# Altium schematic sheet Sheet1.SchDoc
size Tabloid; SheetNumber: 1; SheetTotal: 1; SPICEModelCacheXIFVOIBX: <root> / <DocumentId>XIFVOIBX</DocumentId> / <CacheFrame Number="0"> / <Model Name="3mm_151033bs03000" Kind="CKT"> / <Text>************************************************** / * Manufacturer:           Wurth Elektronik / * Kinds:                  THT Mono-color Round Waterclear / * Matchcode:              WL-TMRW / * Library Type:           LTspice / * Version:                rev22a / * Created/modified by:    Ella / * Date and Time:          2022-02-23 / * Team:                   eiSos EDA Service / * Contact:                libraries@we-online.com / ************************************************** / * Copyright(C) 2022 WÃ¼rth Elektronik eiSos GmbH &amp; Co. KG / * All Rights Reserved. / ************************************************** / * Disclaimer: While WÃ¼rth Elektronik eiSos has made every reasonable effort to ensure the accuracy / * of the simulation models provided, WÃ¼rth Elektronik eiSos does not guarantee the exemption of error on / * the simulation models, nor does WÃ¼rth Elektronik eiSos guarantee that the simulation model is current. / * WÃ¼rth Elektronik eiSos reserves the right to make any adjustments at any time without notice. / * WÃ¼rth Elektronik eiSos expressly disclaims all implied warranties regarding this simulation model. / ************************************************** / .subckt 3mm_151033BS03000  1  2 / D1 1 2 TMRW / .MODEL TMRW D / + IS=273.29E-18 / + N=2.9601 / + RS=1.0279 / + IKF=191.62E-6 / + CJO=1.0000E-12 / + M=.3333 / + VJ=.75 / + BV=5 / + IBV=50.00E-6 / + TT=5.0000E-9 / .ends</Text> / </Model> / </CacheFrame> / </root>
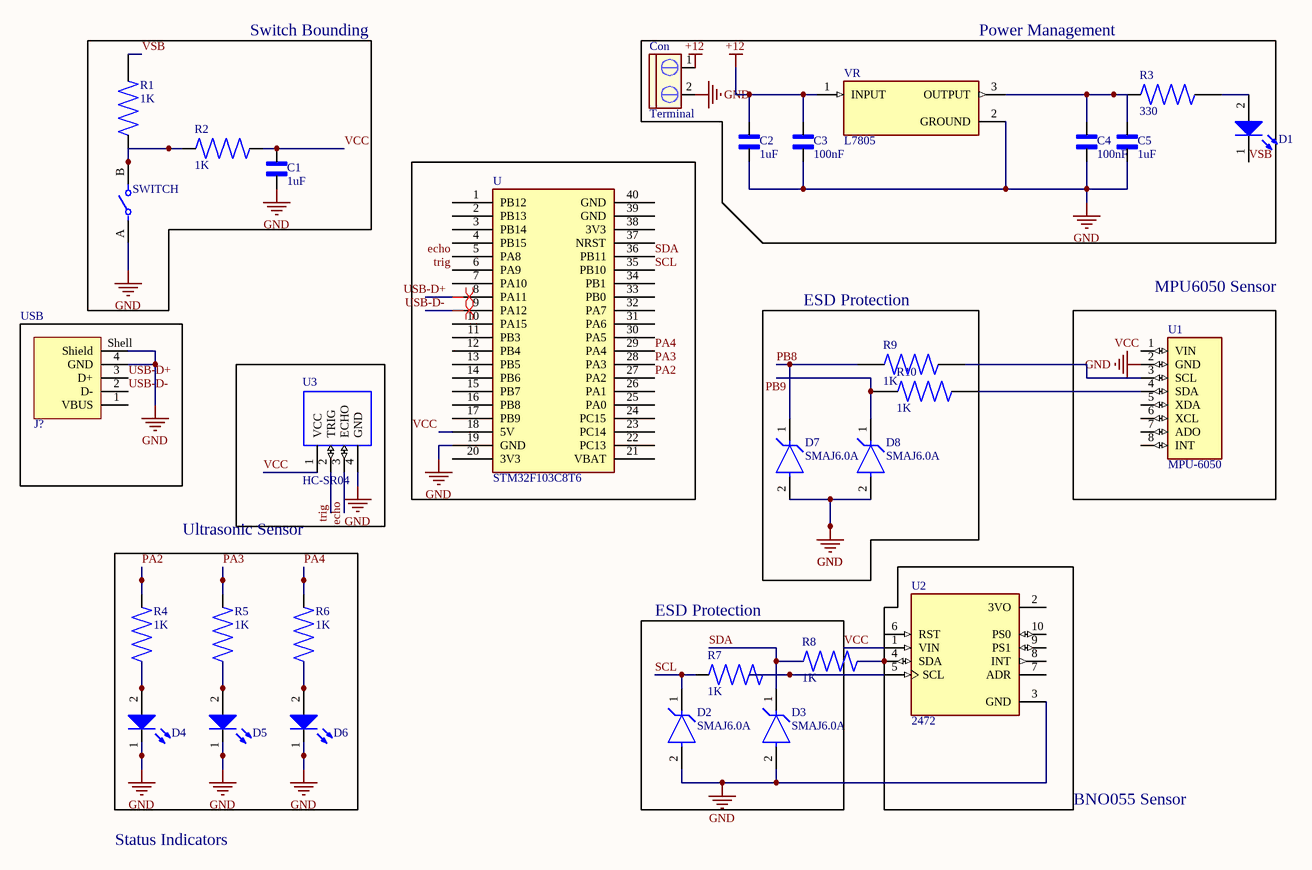
[diagram p0: Sheet1.SchDoc]

## Parts
C1  1uF  [CAPRR254W50L508T317H508]
C2  1uF  [CAPRR254W50L508T317H508]
C3  100nF  [CAPRR254W50L508T317H508]
C4  100nF  [CAPRR254W50L508T317H508]
C5  1uF  [CAPRR254W50L508T317H508]
Con  Terminal  [Terminal Block 2 Pin]
D1  Blue, 2.8V, 30°  [WL-TMRW_D3.9H10.5]  (value not drawn)
D2  SMAJ6.0A  [FP-SMAJ-MFG]
D3  SMAJ6.0A  [FP-SMAJ-MFG]
D4  Blue, 2.8V, 30°  [WL-TMRW_D3.9H10.5]  (value not drawn)
D5  Blue, 2.8V, 30°  [WL-TMRW_D3.9H10.5]  (value not drawn)
D6  Blue, 2.8V, 30°  [WL-TMRW_D3.9H10.5]  (value not drawn)
D7  SMAJ6.0A  [FP-SMAJ-MFG]
D8  SMAJ6.0A  [FP-SMAJ-MFG]
J?  614004134726  [614004134726]  (value not drawn)
R1  1K  [RESAD1100W55L680D260]
R2  1K  [RESAD1100W55L680D260]
R3  330  [RESAD1100W55L680D260]
R4  1K  [RESAD1100W55L680D260]
R5  1K  [RESAD1100W55L680D260]
R6  1K  [RESAD1100W55L680D260]
R7  1K  [RESAD1100W55L680D260]
R8  1K  [RESAD1100W55L680D260]
R9  1K  [RESAD1100W55L680D260]
R10  1K  [RESAD1100W55L680D260]
SWITCH  EVQ-11L07K  [FP-EVQ-11L07K-MFG]  (value not drawn)
U  STM32F103C8T6  [Stm32 BluePill]
U1  MPU-6050  [SEN0142]
U2  2472  [MODULE_2472]
U3  HC-SR04  [XCVR_HC-SR04]
VR  L7805  [TO255P1020X450X2000-3]

## Blocks framed on the sheet
Switch Bounding: C1 R1 R2 SWITCH
USB: J?
ESD Protection: D7 D8 R9 R10
MPU6050 Sensor: U1
Ultrasonic Sensor: D4-D6 R4-R6
ESD Protection: D2 D3 R7 R8

## Nets
+12: C2.2 C3.2 Con.1 VR.1(INPUT)
GND: C1.1 C2.1 C3.1 C4.1 C5.1 Con.2 D2.2(A) D3.2(A) D4.1(K) D5.1(K) D6.1(K) D7.2(A) D8.2(A) J?.4(GND) J?.Shell(Shield) SWITCH.A U.19(GND) U1.2(GND) U2.3(GND) U3.4(GND) VR.2(GROUND)
echo: U.5(PA8) U3.3(ECHO)
PA2: R4.2 U.27(PA2)
PA3: R5.2 U.28(PA3)
PA4: R6.2 U.29(PA4)
PB8: D7.1(C) R9.1
PB9: D8.1(C) R10.1
SCL: D2.1(C) R7.1 U.35(PB10)
SDA: D3.1(C) R8.1 U.36(PB11)
trig: U.6(PA9) U3.2(TRIG)
USB-D+: J?.3(D+) U.8(PA11)
USB-D-: J?.2(D-) U.9(PA12)
VCC: C1.2 R2.2 U.18(5V) U1.1(VIN) U2.1(VIN) U3.1(VCC)
VSB: D1.1(K) R1.2
NetC4_2: C4.2 C5.2 R3.1 VR.3(OUTPUT)
NetD1_2: D1.2(A) R3.2
NetD4_2: D4.2(A) R4.1
NetD5_2: D5.2(A) R5.1
NetD6_2: D6.2(A) R6.1
NetR1_1: R1.1 R2.1 SWITCH.B
NetR7_2: R7.2 U2.5(SCL)
NetR8_2: R8.2 U2.4(SDA)
NetR9_2: R9.2 U1.3(SCL)
NetR10_2: R10.2 U1.4(SDA)

Not connected (* = marked no-connect by the designer): J? 1(VBUS); U 1(PB12) 2(PB13) 3(PB14) 4(PB15) 7(PA10) 10(PA15) 11(PB3) 12(PB4) 13(PB5) 14(PB6) 15(PB7) 16(PB8) 17(PB9) 20(3V3) 21(VBAT) 22(PC13) 23(PC14) 24(PC15) 25(PA0) 26(PA1) 30(PA5) 31(PA6) 32(PA7) 33(PB0) 34(PB1) 37(NRST) 38(3V3) 39(GND) 40(GND); U1 5(XDA) 6(XCL) 7(ADO) 8(INT); U2 2(3VO) 6(RST) 7(ADR) 8(INT) 9(PS1) 10(PS0)

## Layout directives
differential pair: USB-D+, USB-D-

## Notes on the sheet
- Power Management
- BNO055 Sensor
- Status Indicators

## Library data of the parts
C1-C5 = SR201C104KARTR: SR 100nF Ceramic Multilayer Cap,100V dc,+125C,X7R Dielectric,+/-10%,Through Hole | AVX SR201C104KARTR; MF: KYOCERA AVX; SnapEDA_Link: https://www.snapeda.com/parts/SR201C104KARTR/Kyocera/view-part/?ref=snap; Package: None; Value: *; MP: SR201C104KARTR; Check_prices: https://www.snapeda.com/parts/SR201C104KARTR/Kyocera/view-part/?ref=eda
Con = Terminal Block 2: Connector blue screw
D1 D4-D6 = 151033BS03000: WL-TMRW Mono-color Round Waterclear, THT, D3.9 x H10.5mm, Blue, 2.8V, 30°; Manufacturer: Wurth Elektronik; Chip Technology: InGaN; Dominant Wavelength: 470nm; Luminous Intensity: 3800mcd; Peak Wavelength: 465nm; Manufacturer Part Number: 151033BS03000; Category: Signal LEDs; Match Code: WL-TMRW; ComponentLink1Description: Website Link; ComponentLink1URL: https://www.we-online.com/redexpert/article/151033BS03000?ad; ComponentLink2Description: Datasheet Link; ComponentLink2URL: https://www.we-online.com/redexpert/spec/151033BS03000?ad; Mount: Through Hole; Operating Temperature Max: 85°C; Operating Temperature Min: -40°C; Packaging: Bulk; Height: 10.5mm; Diameter: 3.9mm; Emitting Color: Blue; Forward Voltage: 2.8V; Viewing Angle: 30°
D2 D3 D7 D8 = CMP-08607-000083-1: TVS DIODE 6V 10.3V DO214AC; Manufacturer: Littelfuse; Breakdown Voltage: 6.67V; Number Of Channels: 1; Direction: Unidirectional; Max Junction Temp: +150°C; Peak Pulse Current: 38.8A; Peak Pulse Power: 400W; Device Class L1: Circuit Protection; Device Class L3: unset; ComponentLink2URL: https://www.littelfuse.com/~/media/electronics/datasheets/tvs_diodes/littelfuse_tvs_diode_smaj_datasheet.pdf.pdf; Lead Free: Yes; Digikey Description: TVS DIODE 6V 10.3V DO214AC; Height: 2.29mm; Reverse Standoff Voltage: 6V; Package: SMAJ; Manufacturer Part Number: SMAJ6.0A; Octopart: https://octopart.com/smaj6.0a-littelfuse-350212; Category: Diode; Automotive: No; Clamping Voltage: 10.3V; RoHS: TRUE; ComponentLink2Description: Datasheet; Temperature Range Low: -65°C; Temperature: -65°C to +150°C; Temperature Range High: +150°C; Device Class L2: TVS Diodes; Mouser Description: TVS Diodes - Transient Voltage Suppressors 60Vr 400W 4.1A 5% UniDirectional
J? = 614004134726: WR-COM USB 2.0 Type A Up Right; Manufacturer: Wurth Elektronik; Match Code: WR-USB; Gender: Receptacle; Interface Type: Type A; Number of Ports: 1; Rated Current: 1.5A; Working Voltage: 30V (AC); Manufacturer Part Number: 614004134726; Category: Input/Output Connectors; ComponentLink1Description: Website Link; ComponentLink1URL: https://www.we-online.com/redexpert/article/614004134726?ad; ComponentLink2Description: Datasheet Link; ComponentLink2URL: https://www.we-online.com/redexpert/spec/614004134726?ad; Mount: Through Hole; Operating Temperature Max: 105°C; Operating Temperature Min: -40°C; Packaging: Tray; Application: USB 2.0; Number of Pins: 4; Orientation: Up Right
R1-R10 = MFR-25FBF52-1K: 1.07 kOhms Â±1% 0.25W, 1/4W Through Hole Resistor Axial - Metal Film; MF: Yageo; Value: *; SnapEDA_Link: https://www.snapeda.com/parts/MFR-25FBF52-1K/Yageo/view-part/?ref=snap; Purchase-URL: https://pricing.snapeda.com/search/part/MFR-25FBF52-1K/?ref=eda; Availability: In Stock; Price: None; Package: Axial Yageo; Check_prices: https://www.snapeda.com/parts/MFR-25FBF52-1K/Yageo/view-part/?ref=eda; MP: MFR-25FBF52-1K
SWITCH = CMP-00287-55397191-1: EVQ-11L07K Switch Tactile N.O. SPST Round Button PC Pins 0.02A 15VDC 1.6N Thru-Hole Radial T/R; Electrical Life: 100kcycles; Illumination Type: Illuminated, Non-Illuminated; Voltage Rating (DC): 15V; Switch Travel: 250µm; Number of Positions: 2; Current Rating: 20mA; Actuator Length: 3.1mm; Contact Resistance: 50mΩ; Switch Function: Off-Mom; Width: 6mm; Life (Cycles): 100kcycles; Mechanical Life: 100kcycles; Length: 6mm; Min Operating Temperature: -20°C; Orientation: Straight; Operating Force: 1.6N; RoHS: Compliant; Mount: Through Hole; REACH SVHC: Unknown; Number of Pins: 2; Height: 3.9mm; Case/Package: Radial; Max Operating Temperature: 70°C; Contact Current Rating: 20mA; NexarPartId: 55397191; Max Voltage Rating (DC): 15V; Throw Configuration: SPST; Radiation Hardening: No; Termination: PC Pin; Lead Free: Lead Free
U = BluePill: Designed By @Alixahedi
U1 = SEN0142: MPU-6050 series Accelerometer, Gyroscope, 3 Axis Sensor Evaluation Board; MF: DFRobot; SnapEDA_Link: https://www.snapeda.com/parts/SEN0142/DFRobot/view-part/?ref=snap; Package: None; Value: *; MP: SEN0142; Check_prices: https://www.snapeda.com/parts/SEN0142/DFRobot/view-part/?ref=eda
U2 = 2472: Adafruit 9-DOF Absolute Orientation IMU Fusion Breakout - BNO055 | Adafruit Industries 2472; SnapEDA_Link: https://www.snapeda.com/parts/2472/Adafruit+Industries/view-part/?ref=snap; Package: Non-Standard Adafruit; Value: *; MF: Adafruit; MP: 2472; Check_prices: https://www.snapeda.com/parts/2472/Adafruit+Industries/view-part/?ref=eda
U3 = HC-SR04: Ultrasonic Sensor Module; Availability: Unavailable; MP: HC-SR04; Value: *; Price: None; Package: None
VR = L7805: Standard Regulator Pos 5V 1.5A 3-Pin(3+Tab) TO-220FP Tube; MF: STMicroelectronics; MP: L7805; Value: *; SnapEDA_Link: https://www.snapeda.com/parts/L7805/STMicroelectronics/view-part/?ref=snap; Price: None; Package: None; Check_prices: https://www.snapeda.com/parts/L7805/STMicroelectronics/view-part/?ref=eda; Availability: Not in stock